# Altium schematic sheet Camera-Interface.SchDoc
size A3; DocumentNumber: 7; SheetNumber: 7; SheetTotal: 9; PageSetup: Record=PageOptions|CenterHorizontal=True|CenterVertical=True|PrintScale=0.97|XCorrection=1.00|YCorrection=1.00|PrintKind=1|BorderSize=5000000|LeftOffset=0|BottomOffset=0|Orientation=2|PaperLength=2970|PaperWidth=2100|Scale=100|PaperSource=7|PrintQuality=600|MediaType=1|DitherType=10|PaperKind=A4|PrintScaleMode=1
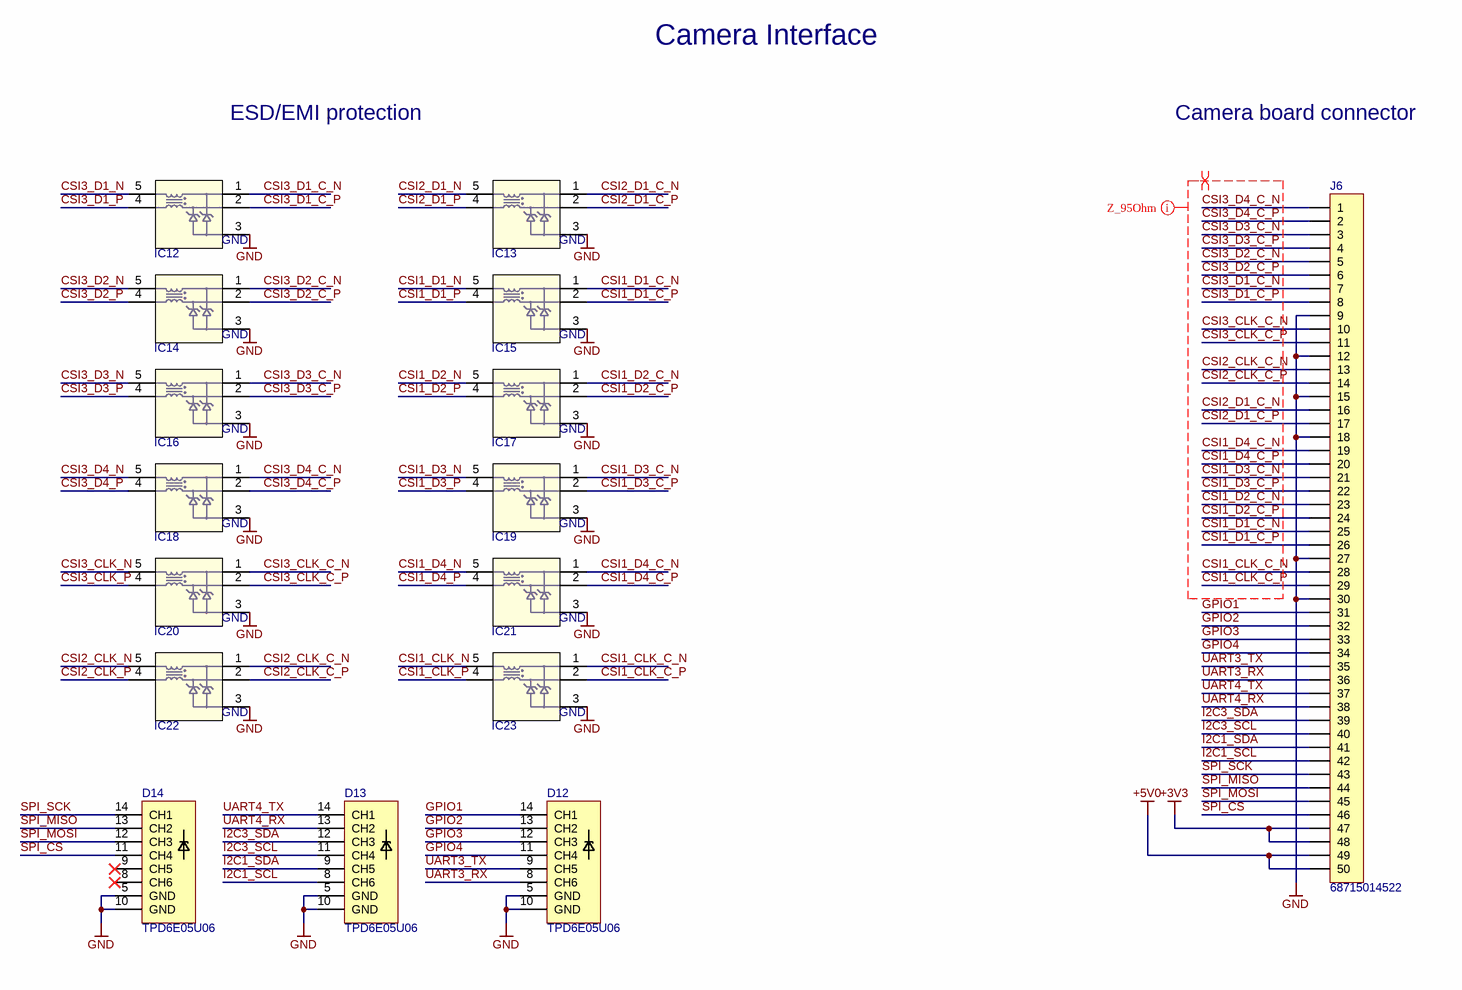
[diagram p0: Camera-Interface.SchDoc]

## Parts
D12  TPD6E05U06  [TPD6E05U06_PASS]
D13  TPD6E05U06  [TPD6E05U06_PASS]
D14  TPD6E05U06  [TPD6E05U06_PASS]
IC12  EClamp8052P  [SGP1917N5]  (value not drawn)
IC13  EClamp8052P  [SGP1917N5]  (value not drawn)
IC14  EClamp8052P  [SGP1917N5]  (value not drawn)
IC15  EClamp8052P  [SGP1917N5]  (value not drawn)
IC16  EClamp8052P  [SGP1917N5]  (value not drawn)
IC17  EClamp8052P  [SGP1917N5]  (value not drawn)
IC18  EClamp8052P  [SGP1917N5]  (value not drawn)
IC19  EClamp8052P  [SGP1917N5]  (value not drawn)
IC20  EClamp8052P  [SGP1917N5]  (value not drawn)
IC21  EClamp8052P  [SGP1917N5]  (value not drawn)
IC22  EClamp8052P  [SGP1917N5]  (value not drawn)
IC23  EClamp8052P  [SGP1917N5]  (value not drawn)
J6  68715014522  [68715014522]

## Nets
+3V3: J6.47 J6.48
+5V0: J6.49 J6.50
GND: D12.5(GND) D12.10(GND) D13.5(GND) D13.10(GND) D14.5(GND) D14.10(GND) IC12.3(GND) IC13.3(GND) IC14.3(GND) IC15.3(GND) IC16.3(GND) IC17.3(GND) IC18.3(GND) IC19.3(GND) IC20.3(GND) IC21.3(GND) IC22.3(GND) IC23.3(GND) J6.9 J6.12 J6.15 J6.18 J6.27 J6.30
CSI1_CLK_C_N: IC23.1 J6.28
CSI1_CLK_C_P: IC23.2 J6.29
CSI1_CLK_N: IC23.5
CSI1_CLK_P: IC23.4
CSI1_D1_C_N: IC15.1 J6.25
CSI1_D1_C_P: IC15.2 J6.26
CSI1_D1_N: IC15.5
CSI1_D1_P: IC15.4
CSI1_D2_C_N: IC17.1 J6.23
CSI1_D2_C_P: IC17.2 J6.24
CSI1_D2_N: IC17.5
CSI1_D2_P: IC17.4
CSI1_D3_C_N: IC19.1 J6.21
CSI1_D3_C_P: IC19.2 J6.22
CSI1_D3_N: IC19.5
CSI1_D3_P: IC19.4
CSI1_D4_C_N: IC21.1 J6.19
CSI1_D4_C_P: IC21.2 J6.20
CSI1_D4_N: IC21.5
CSI1_D4_P: IC21.4
CSI2_CLK_C_N: IC22.1 J6.13
CSI2_CLK_C_P: IC22.2 J6.14
CSI2_CLK_N: IC22.5
CSI2_CLK_P: IC22.4
CSI2_D1_C_N: IC13.1 J6.16
CSI2_D1_C_P: IC13.2 J6.17
CSI2_D1_N: IC13.5
CSI2_D1_P: IC13.4
CSI3_CLK_C_N: IC20.1 J6.10
CSI3_CLK_C_P: IC20.2 J6.11
CSI3_CLK_N: IC20.5
CSI3_CLK_P: IC20.4
CSI3_D1_C_N: IC12.1 J6.7
CSI3_D1_C_P: IC12.2 J6.8
CSI3_D1_N: IC12.5
CSI3_D1_P: IC12.4
CSI3_D2_C_N: IC14.1 J6.5
CSI3_D2_C_P: IC14.2 J6.6
CSI3_D2_N: IC14.5
CSI3_D2_P: IC14.4
CSI3_D3_C_N: IC16.1 J6.3
CSI3_D3_C_P: IC16.2 J6.4
CSI3_D3_N: IC16.5
CSI3_D3_P: IC16.4
CSI3_D4_C_N: IC18.1 J6.1
CSI3_D4_C_P: IC18.2 J6.2
CSI3_D4_N: IC18.5
CSI3_D4_P: IC18.4
GPIO1: D12.14(CH1) J6.31
GPIO2: D12.13(CH2) J6.32
GPIO3: D12.12(CH3) J6.33
GPIO4: D12.11(CH4) J6.34
I2C1_SCL: D13.8(CH6) J6.42
I2C1_SDA: D13.9(CH5) J6.41
I2C3_SCL: D13.11(CH4) J6.40
I2C3_SDA: D13.12(CH3) J6.39
SPI_CS: D14.11(CH4) J6.46
SPI_MISO: D14.13(CH2) J6.44
SPI_MOSI: D14.12(CH3) J6.45
SPI_SCK: D14.14(CH1) J6.43
UART3_RX: D12.8(CH6) J6.36
UART3_TX: D12.9(CH5) J6.35
UART4_RX: D13.13(CH2) J6.38
UART4_TX: D13.14(CH1) J6.37

Not connected (* = marked no-connect by the designer): D14 8(CH6)* 9(CH5)*

## Layout directives
differential pair: CSI1_CLK_C_N, CSI1_CLK_C_P, CSI1_D1_C_N, CSI1_D1_C_P, CSI1_D2_C_N, CSI1_D2_C_P, CSI1_D3_C_N, CSI1_D3_C_P, CSI1_D4_C_N, CSI1_D4_C_P, CSI2_CLK_C_N, CSI2_CLK_C_P, CSI2_D1_C_N, CSI2_D1_C_P, CSI3_CLK_C_N, CSI3_CLK_C_P, CSI3_D1_C_N, CSI3_D1_C_P, CSI3_D2_C_N, CSI3_D2_C_P, CSI3_D3_C_N, CSI3_D3_C_P, CSI3_D4_C_N, CSI3_D4_C_P
net class Z_95Ohm: CSI1_CLK_C_N, CSI1_CLK_C_P, CSI1_D1_C_N, CSI1_D1_C_P, CSI1_D2_C_N, CSI1_D2_C_P, CSI1_D3_C_N, CSI1_D3_C_P, CSI1_D4_C_N, CSI1_D4_C_P, CSI2_CLK_C_N, CSI2_CLK_C_P, CSI2_D1_C_N, CSI2_D1_C_P, CSI3_CLK_C_N, CSI3_CLK_C_P, CSI3_D1_C_N, CSI3_D1_C_P, CSI3_D2_C_N, CSI3_D2_C_P, CSI3_D3_C_N, CSI3_D3_C_P, CSI3_D4_C_N, CSI3_D4_C_P

## Notes on the sheet
- Camera Interface
- ESD/EMI protection
- Camera board connector
- Title:
- Size:
- Date:
- A3
- Revision:
- Page:
- of
- Antmicro Ltd.
- File:
- www.antmicro.com

## Library data of the parts
D12-D14 = TPD6E05U06_PASS: ESD Suppressors 6-CH Pass through layout; Manufacturer: Texas Instruments; Part Symbol: TPD6E05U06RVZR; Part Number: TPD6E05U06_PASS; Value: TPD6E05U06; MPN: TPD6E05U06RVZR
IC12-IC23 = EClamp8052P: 2-Line Common Mode Filter and Low Capacitance ESD Protection for MIPI USB; Manufacturer: SEMTECH; Part Symbol: ECLAMP8052P.TCT; Part Number: EClamp8052P; Value: EClamp8052P; MPN: ECLAMP8052P.TCT
J6 = 1X50: 0.50mm SMT ZIF Horizontal Bottom Contact WR-FPC; Manufacturer: WURTH ELEKTRONIK; Part Number: WE-687-150-145-22; Value: 68715014522; Part Symbol: 68715014522; MPN: 68715014522